# Altium schematic sheet SCH_SHT30.SchDoc
size A4; SheetNumber: 1; SheetTotal: 1; SPICEModelCacheFHZLFEJV: <root> / <DocumentId>FHZLFEJV</DocumentId> / <CacheFrame Number="0"> / <Model Name="cap" Kind="MDL"> / <Text>*Default semiconductor capacitor / .MODEL CAP C()</Text> / </Model> / </CacheFrame> / </root>
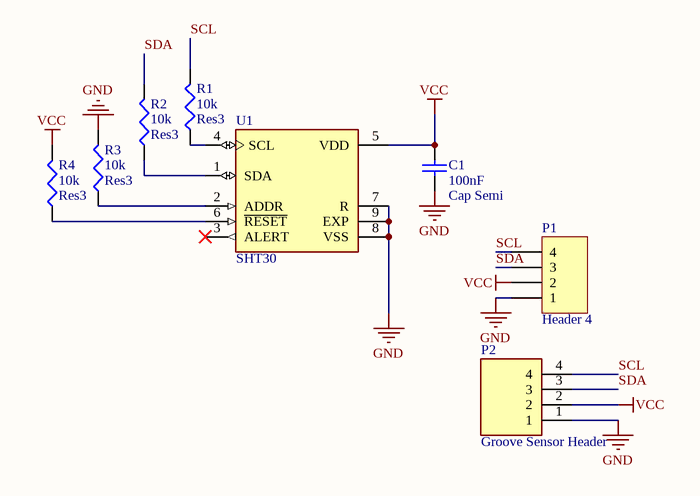
[diagram p0: SCH_SHT30.SchDoc]

## Parts
C1  Cap Semi  value 100nF  [1608[0603]]
P1  Header 4  [HDR1X4]
P2  Groove Sensor Header  [SEEED_110990030]
R1  Res3  value 10k  [J1-0603]
R2  Res3  value 10k  [J1-0603]
R3  Res3  value 10k  [J1-0603]
R4  Res3  value 10k  [J1-0603]
U1  SHT30  [XDCR_SHT30-DIS-B10KS]

## Nets
GND: C1.1 P1.1 P2.1 R3.2 U1.7(R) U1.8(VSS) U1.9(EXP)
VCC: C1.2 P1.2 P2.2 R4.2 U1.5(VDD)
SCL: P1.4 P2.4 R1.2
SDA: P1.3 P2.3 R2.2
NetR1_1: R1.1 U1.4(SCL)
NetR2_1: R2.1 U1.1(SDA)
NetR3_1: R3.1 U1.2(ADDR)
NetR4_1: R4.1 U1.6(~{RESET})

Not connected (* = marked no-connect by the designer): U1 3(ALERT)*

## Library data of the parts
C1 = Cap Semi: Capacitor (Semiconductor SIM Model); Published: 8-Jun-2000; LatestRevisionDate: 29-May-2009; LatestRevisionNote: IPC-7351 Footprint Added.; PackageReference: C1206; Publisher: Altium Limited; PackageDescription: Chip Capacitor
P1 = Header 4: Header, 4-Pin; LatestRevisionDate: 17-Jul-2002; LatestRevisionNote: Re-released for DXP Platform.; Publisher: Altium Limited
P2 = CMP-002-00072-1: GROVE 2MM 4PIN VERT CONN 10PCS; MF: Seeed Technology; Pins: 4; Component Type: Standard; SnapEDA_Link: https://www.snapeda.com/parts/110990030/Seeed%20Technology%20Co.,%20Ltd/view-part/583576/?ref=snap; Value: *; Mouser-Purchase-URL: https://snapeda.com/shop?store=Mouser&id=583576; Design Item ID: 110990030; MP: 110990030; Availability: Good; Arrow_Electronics-Purchase-URL: https://snapeda.com/shop?store=Arrow+Electronics&id=583576; Price: None; Case/Package: None; Source: 110990030.SchLib
R1-R4 = Res3: Resistor; Published: 8-Jun-2000; LatestRevisionDate: 29-May-2009; LatestRevisionNote: IPC-7351 Footprint Added.; PackageReference: J1-0603; Publisher: Altium Limited; PackageDescription: Chip Resistor
U1 = SHT30-DIS-B10KS: SENSOR HUMID/TEMP 5V I2C 2% SMD; Package: None; Price: None; Value: *; MP: SHT30-DIS-B10KS; Availability: Unavailable